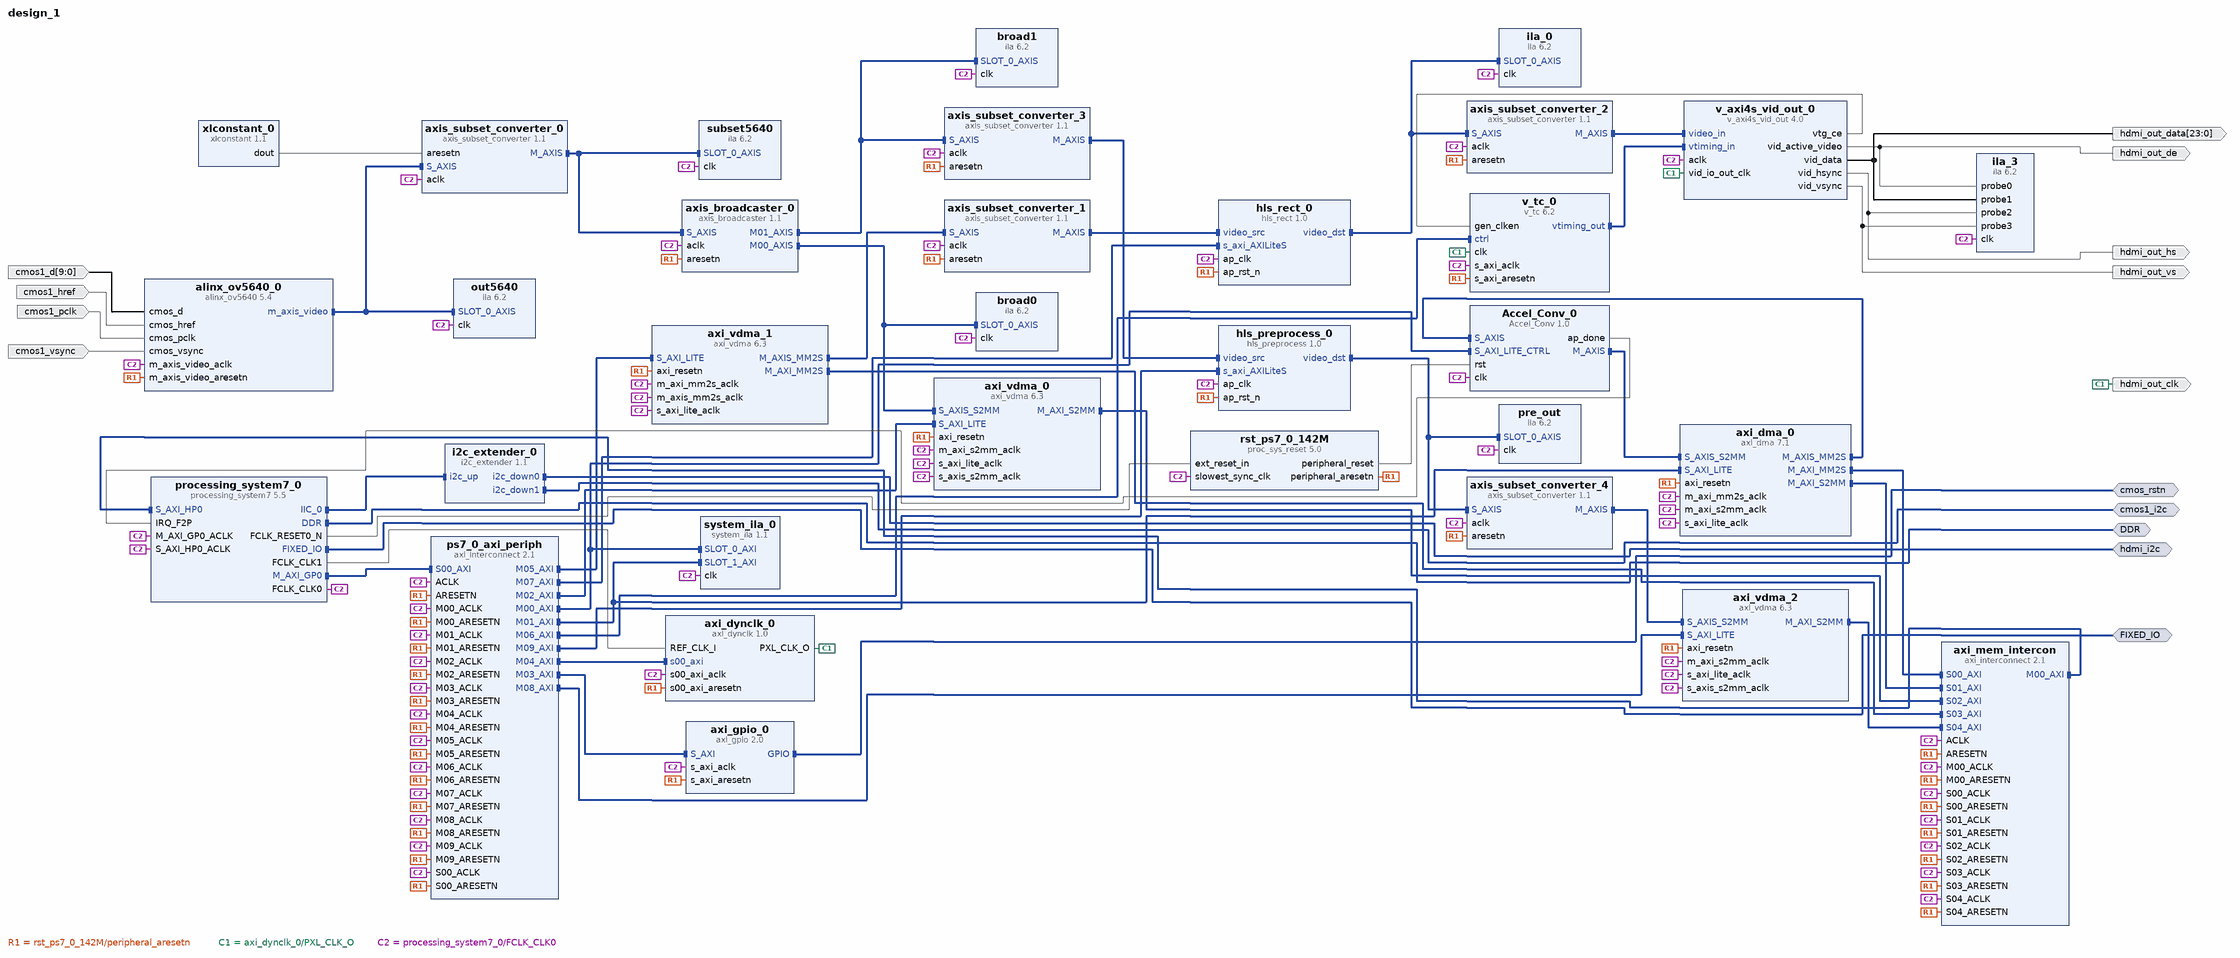
[diagram p0: block diagram of the top level]
# Vivado block design design_1, xc7z035ffg676-2, Vivado 2021.1
create_bd_design design_1

create_bd_intf_port -mode Master -vlnv xilinx.com:interface:ddrx_rtl:1.0 DDR
create_bd_intf_port -mode Master -vlnv xilinx.com:display_processing_system7:fixedio_rtl:1.0 FIXED_IO
create_bd_intf_port -mode Master -vlnv xilinx.com:interface:gpio_rtl:1.0 cmos_rstn
create_bd_intf_port -mode Master -vlnv xilinx.com:interface:iic_rtl:1.0 hdmi_i2c
create_bd_intf_port -mode Master -vlnv xilinx.com:interface:iic_rtl:1.0 cmos1_i2c
create_bd_port -dir O -type clk hdmi_out_clk
create_bd_port -dir O hdmi_out_de
create_bd_port -dir O -from 23 -to 0 hdmi_out_data
create_bd_port -dir O hdmi_out_hs
create_bd_port -dir O hdmi_out_vs
create_bd_port -dir I cmos1_vsync
create_bd_port -dir I cmos1_href
create_bd_port -dir I cmos1_pclk
create_bd_port -dir I -from 9 -to 0 cmos1_d

create_bd_cell -type ip -vlnv xilinx.com:ip:processing_system7:5.5 processing_system7_0
set_property -dict [list \
  CONFIG.PCW_APU_PERIPHERAL_FREQMHZ 666.666666 \
  CONFIG.PCW_CPU_CPU_6X4X_MAX_RANGE 800 \
  CONFIG.PCW_DUAL_PARALLEL_QSPI_DATA_MODE x8 \
  CONFIG.PCW_ENET0_ENET0_IO {MIO 16 .. 27} \
  CONFIG.PCW_ENET0_GRP_MDIO_ENABLE 1 \
  CONFIG.PCW_ENET0_GRP_MDIO_IO {MIO 52 .. 53} \
  CONFIG.PCW_ENET0_PERIPHERAL_ENABLE 1 \
  CONFIG.PCW_ENET_RESET_ENABLE 0 \
  CONFIG.PCW_EN_CLK1_PORT 1 \
  CONFIG.PCW_FCLK_CLK1_BUF TRUE \
  CONFIG.PCW_FPGA0_PERIPHERAL_FREQMHZ 200 \
  CONFIG.PCW_FPGA1_PERIPHERAL_FREQMHZ 100 \
  CONFIG.PCW_FPGA_FCLK1_ENABLE 1 \
  CONFIG.PCW_GPIO_MIO_GPIO_ENABLE 1 \
  CONFIG.PCW_GPIO_MIO_GPIO_IO MIO \
  CONFIG.PCW_I2C0_I2C0_IO EMIO \
  CONFIG.PCW_I2C0_PERIPHERAL_ENABLE 1 \
  CONFIG.PCW_I2C_PERIPHERAL_FREQMHZ 111.111115 \
  CONFIG.PCW_I2C_RESET_ENABLE 0 \
  CONFIG.PCW_IRQ_F2P_INTR 1 \
  CONFIG.PCW_PERIPHERAL_BOARD_PRESET None \
  CONFIG.PCW_PRESET_BANK1_VOLTAGE {LVCMOS 1.8V} \
  CONFIG.PCW_QSPI_GRP_FBCLK_ENABLE 1 \
  CONFIG.PCW_QSPI_GRP_IO1_ENABLE 1 \
  CONFIG.PCW_QSPI_GRP_IO1_IO {MIO 0 9 .. 13} \
  CONFIG.PCW_QSPI_GRP_SINGLE_SS_ENABLE 0 \
  CONFIG.PCW_QSPI_INTERNAL_HIGHADDRESS 0xFDFFFFFF \
  CONFIG.PCW_QSPI_PERIPHERAL_ENABLE 1 \
  CONFIG.PCW_QSPI_QSPI_IO {MIO 1 .. 6} \
  CONFIG.PCW_SD0_GRP_CD_ENABLE 0 \
  CONFIG.PCW_SD0_GRP_WP_ENABLE 0 \
  CONFIG.PCW_SD0_PERIPHERAL_ENABLE 1 \
  CONFIG.PCW_SD0_SD0_IO {MIO 40 .. 45} \
  CONFIG.PCW_SD1_PERIPHERAL_ENABLE 1 \
  CONFIG.PCW_SD1_SD1_IO {MIO 46 .. 51} \
  CONFIG.PCW_SDIO_PERIPHERAL_FREQMHZ 100 \
  CONFIG.PCW_UART0_PERIPHERAL_ENABLE 1 \
  CONFIG.PCW_UART0_UART0_IO {MIO 14 .. 15} \
  CONFIG.PCW_UART1_PERIPHERAL_ENABLE 0 \
  CONFIG.PCW_UART_PERIPHERAL_FREQMHZ 100 \
  CONFIG.PCW_UIPARAM_DDR_FREQ_MHZ 533.333333 \
  CONFIG.PCW_UIPARAM_DDR_PARTNO {MT41J256M16 RE-125} \
  CONFIG.PCW_USB0_PERIPHERAL_ENABLE 1 \
  CONFIG.PCW_USB0_USB0_IO {MIO 28 .. 39} \
  CONFIG.PCW_USB_RESET_ENABLE 0 \
  CONFIG.PCW_USE_FABRIC_INTERRUPT 1 \
  CONFIG.PCW_USE_S_AXI_HP0 1 \
] [get_bd_cells processing_system7_0]
# 516 more settings of processing_system7_0 are not shown: defaults, MIO pin electricals, DDR timing, and values the tool derives
create_bd_cell -type ip -vlnv xilinx.com:ip:axi_dma:7.1 axi_dma_0
set_property -dict [list \
  CONFIG.c_include_sg 0 \
  CONFIG.c_m_axi_mm2s_data_width 64 \
  CONFIG.c_m_axi_s2mm_data_width 64 \
  CONFIG.c_m_axis_mm2s_tdata_width 64 \
  CONFIG.c_mm2s_burst_size 256 \
  CONFIG.c_s2mm_burst_size 256 \
  CONFIG.c_s_axis_s2mm_tdata_width 64 \
  CONFIG.c_sg_length_width 19 \
] [get_bd_cells axi_dma_0]
create_bd_cell -type ip -vlnv xilinx.com:ip:axi_interconnect:2.1 ps7_0_axi_periph
set_property -dict {CONFIG.NUM_MI 10} [get_bd_cells ps7_0_axi_periph]
create_bd_cell -type ip -vlnv xilinx.com:ip:proc_sys_reset:5.0 rst_ps7_0_142M
create_bd_cell -type ip -vlnv xilinx.com:ip:axi_interconnect:2.1 axi_mem_intercon
set_property -dict {CONFIG.NUM_MI 1 CONFIG.NUM_SI 5} [get_bd_cells axi_mem_intercon]
create_bd_cell -type ip -vlnv xilinx.com:ip:system_ila:1.1 system_ila_0
set_property -dict [list \
  CONFIG.C_MON_TYPE INTERFACE \
  CONFIG.C_NUM_MONITOR_SLOTS 2 \
  CONFIG.C_SLOT_0_APC_EN 0 \
  CONFIG.C_SLOT_0_AXI_AR_SEL_DATA 1 \
  CONFIG.C_SLOT_0_AXI_AR_SEL_TRIG 1 \
  CONFIG.C_SLOT_0_AXI_AW_SEL_DATA 1 \
  CONFIG.C_SLOT_0_AXI_AW_SEL_TRIG 1 \
  CONFIG.C_SLOT_0_AXI_B_SEL_DATA 1 \
  CONFIG.C_SLOT_0_AXI_B_SEL_TRIG 1 \
  CONFIG.C_SLOT_0_AXI_R_SEL_DATA 1 \
  CONFIG.C_SLOT_0_AXI_R_SEL_TRIG 1 \
  CONFIG.C_SLOT_0_AXI_W_SEL_DATA 1 \
  CONFIG.C_SLOT_0_AXI_W_SEL_TRIG 1 \
  CONFIG.C_SLOT_0_INTF_TYPE xilinx.com:interface:aximm_rtl:1.0 \
  CONFIG.C_SLOT_1_APC_EN 0 \
  CONFIG.C_SLOT_1_AXI_AR_SEL_DATA 1 \
  CONFIG.C_SLOT_1_AXI_AR_SEL_TRIG 1 \
  CONFIG.C_SLOT_1_AXI_AW_SEL_DATA 1 \
  CONFIG.C_SLOT_1_AXI_AW_SEL_TRIG 1 \
  CONFIG.C_SLOT_1_AXI_B_SEL_DATA 1 \
  CONFIG.C_SLOT_1_AXI_B_SEL_TRIG 1 \
  CONFIG.C_SLOT_1_AXI_R_SEL_DATA 1 \
  CONFIG.C_SLOT_1_AXI_R_SEL_TRIG 1 \
  CONFIG.C_SLOT_1_AXI_W_SEL_DATA 1 \
  CONFIG.C_SLOT_1_AXI_W_SEL_TRIG 1 \
  CONFIG.C_SLOT_1_INTF_TYPE xilinx.com:interface:aximm_rtl:1.0 \
] [get_bd_cells system_ila_0]
create_bd_cell -type ip -vlnv www.alinx.com.cn:user:alinx_ov5640:5.4 alinx_ov5640_0
create_bd_cell -type ip -vlnv xilinx.com:ip:axis_subset_converter:1.1 axis_subset_converter_0
set_property -dict [list \
  CONFIG.M_HAS_TKEEP 1 \
  CONFIG.M_HAS_TLAST 1 \
  CONFIG.M_TDATA_NUM_BYTES 3 \
  CONFIG.M_TUSER_WIDTH 1 \
  CONFIG.S_HAS_TKEEP 1 \
  CONFIG.S_HAS_TLAST 1 \
  CONFIG.S_TDATA_NUM_BYTES 2 \
  CONFIG.S_TUSER_WIDTH 1 \
  CONFIG.TDATA_REMAP {tdata[4:0],3'b000,tdata[10:5],2'b00,tdata[15:11],3'b000} \
  CONFIG.TKEEP_REMAP {1'b1,tkeep[1:0]} \
  CONFIG.TLAST_REMAP {tlast[0]} \
  CONFIG.TUSER_REMAP {tuser[0:0]} \
] [get_bd_cells axis_subset_converter_0]
create_bd_cell -type ip -vlnv xilinx.com:ip:axi_vdma:6.3 axi_vdma_0
set_property -dict [list \
  CONFIG.c_include_mm2s 0 \
  CONFIG.c_include_s2mm_dre 1 \
  CONFIG.c_m_axi_s2mm_data_width 64 \
  CONFIG.c_num_fstores 1 \
  CONFIG.c_s2mm_genlock_mode 0 \
  CONFIG.c_s2mm_linebuffer_depth 4096 \
  CONFIG.c_s2mm_max_burst_length 128 \
] [get_bd_cells axi_vdma_0]
create_bd_cell -type ip -vlnv xilinx.com:ip:xlconstant:1.1 xlconstant_0
create_bd_cell -type ip -vlnv xilinx.com:ip:axi_gpio:2.0 axi_gpio_0
set_property -dict {CONFIG.C_ALL_OUTPUTS 1 CONFIG.C_GPIO_WIDTH 1} [get_bd_cells axi_gpio_0]
create_bd_cell -type ip -vlnv digilentinc.com:ip:axi_dynclk:1.0 axi_dynclk_0
create_bd_cell -type ip -vlnv xilinx.com:ip:v_tc:6.2 v_tc_0
set_property -dict {CONFIG.enable_detection false} [get_bd_cells v_tc_0]
create_bd_cell -type ip -vlnv xilinx.com:ip:v_axi4s_vid_out:4.0 v_axi4s_vid_out_0
set_property -dict {CONFIG.C_HAS_ASYNC_CLK 1 CONFIG.C_VTG_MASTER_SLAVE 1} [get_bd_cells v_axi4s_vid_out_0]
create_bd_cell -type ip -vlnv xilinx.com:ip:axi_vdma:6.3 axi_vdma_1
set_property -dict [list \
  CONFIG.c_include_mm2s 1 \
  CONFIG.c_include_s2mm 0 \
  CONFIG.c_m_axis_mm2s_tdata_width 24 \
  CONFIG.c_mm2s_genlock_mode 3 \
  CONFIG.c_mm2s_max_burst_length 128 \
  CONFIG.c_num_fstores 1 \
] [get_bd_cells axi_vdma_1]
create_bd_cell -type ip -vlnv alinx.com.cn:user:i2c_extender:1.1 i2c_extender_0
create_bd_cell -type ip -vlnv xilinx.com:ip:ila:6.2 ila_3
set_property -dict [list \
  CONFIG.C_ENABLE_ILA_AXI_MON false \
  CONFIG.C_MONITOR_TYPE Native \
  CONFIG.C_NUM_OF_PROBES 4 \
  CONFIG.C_PROBE1_WIDTH 24 \
] [get_bd_cells ila_3]
create_bd_cell -type ip -vlnv xilinx.com:ip:axis_subset_converter:1.1 axis_subset_converter_1
set_property -dict [list \
  CONFIG.M_TDATA_NUM_BYTES 4 \
  CONFIG.S_TDATA_NUM_BYTES 3 \
  CONFIG.TDATA_REMAP {8'b00000000,tdata[23:0]} \
] [get_bd_cells axis_subset_converter_1]
create_bd_cell -type ip -vlnv xilinx.com:hls:hls_rect:1.0 hls_rect_0
create_bd_cell -type ip -vlnv xilinx.com:ip:axis_subset_converter:1.1 axis_subset_converter_2
set_property -dict [list \
  CONFIG.M_TDATA_NUM_BYTES 3 \
  CONFIG.S_TDATA_NUM_BYTES 4 \
  CONFIG.TDATA_REMAP {tdata[23:0]} \
] [get_bd_cells axis_subset_converter_2]
create_bd_cell -type ip -vlnv xilinx.com:ip:ila:6.2 ila_0
set_property -dict {CONFIG.C_NUM_OF_PROBES 9 CONFIG.C_SLOT_0_AXI_PROTOCOL AXI4S} [get_bd_cells ila_0]
create_bd_cell -type ip -vlnv xilinx.com:ip:ila:6.2 out5640
set_property -dict {CONFIG.C_NUM_OF_PROBES 9 CONFIG.C_SLOT_0_AXI_PROTOCOL AXI4S} [get_bd_cells out5640]
create_bd_cell -type ip -vlnv xilinx.com:ip:ila:6.2 subset5640
set_property -dict {CONFIG.C_NUM_OF_PROBES 9 CONFIG.C_SLOT_0_AXI_PROTOCOL AXI4S} [get_bd_cells subset5640]
create_bd_cell -type ip -vlnv xilinx.com:ip:axis_subset_converter:1.1 axis_subset_converter_3
set_property -dict [list \
  CONFIG.M_TDATA_NUM_BYTES 4 \
  CONFIG.S_TDATA_NUM_BYTES 3 \
  CONFIG.TDATA_REMAP {8'b00000000,tdata[23:0]} \
] [get_bd_cells axis_subset_converter_3]
create_bd_cell -type ip -vlnv xilinx.com:ip:axis_broadcaster:1.1 axis_broadcaster_0
set_property -dict [list \
  CONFIG.M00_TDATA_REMAP {tdata[23:0]} \
  CONFIG.M01_TDATA_REMAP {tdata[23:0]} \
  CONFIG.M_TDATA_NUM_BYTES 3 \
  CONFIG.S_TDATA_NUM_BYTES 3 \
] [get_bd_cells axis_broadcaster_0]
create_bd_cell -type ip -vlnv xilinx.com:ip:ila:6.2 broad0
set_property -dict {CONFIG.C_NUM_OF_PROBES 9 CONFIG.C_SLOT_0_AXI_PROTOCOL AXI4S} [get_bd_cells broad0]
create_bd_cell -type ip -vlnv xilinx.com:ip:ila:6.2 broad1
set_property -dict {CONFIG.C_NUM_OF_PROBES 9 CONFIG.C_SLOT_0_AXI_PROTOCOL AXI4S} [get_bd_cells broad1]
create_bd_cell -type ip -vlnv xilinx.com:ip:axi_vdma:6.3 axi_vdma_2
set_property -dict {CONFIG.c_include_mm2s 0} [get_bd_cells axi_vdma_2]
create_bd_cell -type ip -vlnv xilinx.com:ip:ila:6.2 pre_out
set_property -dict {CONFIG.C_NUM_OF_PROBES 9 CONFIG.C_SLOT_0_AXI_PROTOCOL AXI4S} [get_bd_cells pre_out]
create_bd_cell -type ip -vlnv xilinx.com:ip:axis_subset_converter:1.1 axis_subset_converter_4
set_property -dict [list \
  CONFIG.M_TDATA_NUM_BYTES 8 \
  CONFIG.S_TDATA_NUM_BYTES 4 \
  CONFIG.TDATA_REMAP {32'b00000000000000000000000000000000,tdata[31:0]} \
] [get_bd_cells axis_subset_converter_4]
create_bd_cell -type ip -vlnv xilinx.com:hls:hls_preprocess:1.0 hls_preprocess_0
create_bd_cell -type ip -vlnv xilinx.com:user:Accel_Conv:1.0 Accel_Conv_0

# ---- connections ----

connect_bd_intf_net [get_bd_intf_pins Accel_Conv_0/M_AXIS] [get_bd_intf_pins axi_dma_0/S_AXIS_S2MM]
connect_bd_intf_net [get_bd_intf_pins alinx_ov5640_0/m_axis_video] [get_bd_intf_pins axis_subset_converter_0/S_AXIS]
connect_bd_intf_net [get_bd_intf_pins alinx_ov5640_0/m_axis_video] [get_bd_intf_pins out5640/SLOT_0_AXIS]
connect_bd_intf_net [get_bd_intf_pins Accel_Conv_0/S_AXIS] [get_bd_intf_pins axi_dma_0/M_AXIS_MM2S]
connect_bd_intf_net [get_bd_intf_pins axi_dma_0/M_AXI_MM2S] [get_bd_intf_pins axi_mem_intercon/S00_AXI]
connect_bd_intf_net [get_bd_intf_pins axi_dma_0/M_AXI_S2MM] [get_bd_intf_pins axi_mem_intercon/S01_AXI]
connect_bd_intf_net [get_bd_intf_ports cmos_rstn] [get_bd_intf_pins axi_gpio_0/GPIO]
connect_bd_intf_net [get_bd_intf_pins axi_mem_intercon/M00_AXI] [get_bd_intf_pins processing_system7_0/S_AXI_HP0]
connect_bd_intf_net [get_bd_intf_pins axi_vdma_0/M_AXI_S2MM] [get_bd_intf_pins axi_mem_intercon/S02_AXI]
connect_bd_intf_net [get_bd_intf_pins axi_vdma_1/M_AXIS_MM2S] [get_bd_intf_pins axis_subset_converter_1/S_AXIS]
connect_bd_intf_net [get_bd_intf_pins axi_vdma_1/M_AXI_MM2S] [get_bd_intf_pins axi_mem_intercon/S03_AXI]
connect_bd_intf_net [get_bd_intf_pins axi_vdma_2/M_AXI_S2MM] [get_bd_intf_pins axi_mem_intercon/S04_AXI]
connect_bd_intf_net [get_bd_intf_pins axis_broadcaster_0/M00_AXIS] [get_bd_intf_pins axi_vdma_0/S_AXIS_S2MM]
connect_bd_intf_net [get_bd_intf_pins axis_broadcaster_0/M00_AXIS] [get_bd_intf_pins broad0/SLOT_0_AXIS]
connect_bd_intf_net [get_bd_intf_pins axis_broadcaster_0/M01_AXIS] [get_bd_intf_pins axis_subset_converter_3/S_AXIS]
connect_bd_intf_net [get_bd_intf_pins axis_broadcaster_0/M01_AXIS] [get_bd_intf_pins broad1/SLOT_0_AXIS]
connect_bd_intf_net [get_bd_intf_pins axis_subset_converter_0/M_AXIS] [get_bd_intf_pins axis_broadcaster_0/S_AXIS]
connect_bd_intf_net [get_bd_intf_pins axis_subset_converter_0/M_AXIS] [get_bd_intf_pins subset5640/SLOT_0_AXIS]
connect_bd_intf_net [get_bd_intf_pins axis_subset_converter_1/M_AXIS] [get_bd_intf_pins hls_rect_0/video_src]
connect_bd_intf_net [get_bd_intf_pins axis_subset_converter_2/M_AXIS] [get_bd_intf_pins v_axi4s_vid_out_0/video_in]
connect_bd_intf_net [get_bd_intf_pins axis_subset_converter_3/M_AXIS] [get_bd_intf_pins hls_preprocess_0/video_src]
connect_bd_intf_net [get_bd_intf_pins axis_subset_converter_4/M_AXIS] [get_bd_intf_pins axi_vdma_2/S_AXIS_S2MM]
connect_bd_intf_net [get_bd_intf_pins axis_subset_converter_4/S_AXIS] [get_bd_intf_pins hls_preprocess_0/video_dst]
connect_bd_intf_net [get_bd_intf_pins axis_subset_converter_4/S_AXIS] [get_bd_intf_pins pre_out/SLOT_0_AXIS]
connect_bd_intf_net [get_bd_intf_pins hls_rect_0/video_dst] [get_bd_intf_pins axis_subset_converter_2/S_AXIS]
connect_bd_intf_net [get_bd_intf_pins hls_rect_0/video_dst] [get_bd_intf_pins ila_0/SLOT_0_AXIS]
connect_bd_intf_net [get_bd_intf_ports hdmi_i2c] [get_bd_intf_pins i2c_extender_0/i2c_down0]
connect_bd_intf_net [get_bd_intf_ports cmos1_i2c] [get_bd_intf_pins i2c_extender_0/i2c_down1]
connect_bd_intf_net [get_bd_intf_ports DDR] [get_bd_intf_pins processing_system7_0/DDR]
connect_bd_intf_net [get_bd_intf_ports FIXED_IO] [get_bd_intf_pins processing_system7_0/FIXED_IO]
connect_bd_intf_net [get_bd_intf_pins processing_system7_0/IIC_0] [get_bd_intf_pins i2c_extender_0/i2c_up]
connect_bd_intf_net [get_bd_intf_pins processing_system7_0/M_AXI_GP0] [get_bd_intf_pins ps7_0_axi_periph/S00_AXI]
connect_bd_intf_net -intf_net ps7_0_axi_periph_M00_AXI [get_bd_intf_pins ps7_0_axi_periph/M00_AXI] [get_bd_intf_pins Accel_Conv_0/S_AXI_LITE_CTRL]
connect_bd_intf_net [get_bd_intf_pins ps7_0_axi_periph/M00_AXI] [get_bd_intf_pins system_ila_0/SLOT_0_AXI]
connect_bd_intf_net -intf_net ps7_0_axi_periph_M01_AXI [get_bd_intf_pins ps7_0_axi_periph/M01_AXI] [get_bd_intf_pins axi_dma_0/S_AXI_LITE]
connect_bd_intf_net [get_bd_intf_pins ps7_0_axi_periph/M01_AXI] [get_bd_intf_pins system_ila_0/SLOT_1_AXI]
connect_bd_intf_net [get_bd_intf_pins ps7_0_axi_periph/M02_AXI] [get_bd_intf_pins axi_vdma_0/S_AXI_LITE]
connect_bd_intf_net [get_bd_intf_pins ps7_0_axi_periph/M03_AXI] [get_bd_intf_pins axi_gpio_0/S_AXI]
connect_bd_intf_net [get_bd_intf_pins ps7_0_axi_periph/M04_AXI] [get_bd_intf_pins axi_dynclk_0/s00_axi]
connect_bd_intf_net [get_bd_intf_pins ps7_0_axi_periph/M05_AXI] [get_bd_intf_pins axi_vdma_1/S_AXI_LITE]
connect_bd_intf_net [get_bd_intf_pins ps7_0_axi_periph/M06_AXI] [get_bd_intf_pins v_tc_0/ctrl]
connect_bd_intf_net [get_bd_intf_pins ps7_0_axi_periph/M07_AXI] [get_bd_intf_pins hls_rect_0/s_axi_AXILiteS]
connect_bd_intf_net [get_bd_intf_pins ps7_0_axi_periph/M08_AXI] [get_bd_intf_pins axi_vdma_2/S_AXI_LITE]
connect_bd_intf_net [get_bd_intf_pins ps7_0_axi_periph/M09_AXI] [get_bd_intf_pins hls_preprocess_0/s_axi_AXILiteS]
connect_bd_intf_net [get_bd_intf_pins v_tc_0/vtiming_out] [get_bd_intf_pins v_axi4s_vid_out_0/vtiming_in]
connect_bd_net -net ARESETN_1 [get_bd_pins rst_ps7_0_142M/peripheral_aresetn] \
  [get_bd_pins ps7_0_axi_periph/ARESETN] [get_bd_pins ps7_0_axi_periph/S00_ARESETN] \
  [get_bd_pins ps7_0_axi_periph/M00_ARESETN] [get_bd_pins ps7_0_axi_periph/M01_ARESETN] \
  [get_bd_pins alinx_ov5640_0/m_axis_video_aresetn] [get_bd_pins axi_mem_intercon/S02_ARESETN] \
  [get_bd_pins axi_vdma_0/axi_resetn] [get_bd_pins ps7_0_axi_periph/M02_ARESETN] [get_bd_pins axi_dma_0/axi_resetn] \
  [get_bd_pins axi_gpio_0/s_axi_aresetn] [get_bd_pins ps7_0_axi_periph/M03_ARESETN] [get_bd_pins axi_mem_intercon/ARESETN] \
  [get_bd_pins axi_mem_intercon/S00_ARESETN] [get_bd_pins axi_mem_intercon/M00_ARESETN] \
  [get_bd_pins axi_mem_intercon/S01_ARESETN] [get_bd_pins axi_dynclk_0/s00_axi_aresetn] \
  [get_bd_pins ps7_0_axi_periph/M04_ARESETN] [get_bd_pins axi_mem_intercon/S03_ARESETN] [get_bd_pins axi_vdma_1/axi_resetn] \
  [get_bd_pins ps7_0_axi_periph/M05_ARESETN] [get_bd_pins v_tc_0/s_axi_aresetn] [get_bd_pins ps7_0_axi_periph/M06_ARESETN] \
  [get_bd_pins ps7_0_axi_periph/M07_ARESETN] [get_bd_pins axis_subset_converter_1/aresetn] [get_bd_pins hls_rect_0/ap_rst_n] \
  [get_bd_pins axis_subset_converter_2/aresetn] [get_bd_pins axi_mem_intercon/S04_ARESETN] \
  [get_bd_pins axi_vdma_2/axi_resetn] [get_bd_pins ps7_0_axi_periph/M08_ARESETN] [get_bd_pins axis_broadcaster_0/aresetn] \
  [get_bd_pins axis_subset_converter_3/aresetn] [get_bd_pins ps7_0_axi_periph/M09_ARESETN] \
  [get_bd_pins axis_subset_converter_4/aresetn] [get_bd_pins hls_preprocess_0/ap_rst_n]
connect_bd_net [get_bd_pins Accel_Conv_0/ap_done] [get_bd_pins processing_system7_0/IRQ_F2P]
connect_bd_net [get_bd_pins axi_dynclk_0/PXL_CLK_O] \
  [get_bd_ports hdmi_out_clk] [get_bd_pins v_tc_0/clk] [get_bd_pins v_axi4s_vid_out_0/vid_io_out_clk]
connect_bd_net -net cmos_d_0_1 [get_bd_ports cmos1_d] [get_bd_pins alinx_ov5640_0/cmos_d]
connect_bd_net -net cmos_href_0_1 [get_bd_ports cmos1_href] [get_bd_pins alinx_ov5640_0/cmos_href]
connect_bd_net -net cmos_pclk_0_1 [get_bd_ports cmos1_pclk] [get_bd_pins alinx_ov5640_0/cmos_pclk]
connect_bd_net -net cmos_vsync_0_1 [get_bd_ports cmos1_vsync] [get_bd_pins alinx_ov5640_0/cmos_vsync]
connect_bd_net [get_bd_pins processing_system7_0/FCLK_CLK0] \
  [get_bd_pins processing_system7_0/M_AXI_GP0_ACLK] [get_bd_pins processing_system7_0/S_AXI_HP0_ACLK] \
  [get_bd_pins axi_dma_0/s_axi_lite_aclk] [get_bd_pins axi_dma_0/m_axi_mm2s_aclk] [get_bd_pins axi_dma_0/m_axi_s2mm_aclk] \
  [get_bd_pins ps7_0_axi_periph/ACLK] [get_bd_pins ps7_0_axi_periph/S00_ACLK] [get_bd_pins rst_ps7_0_142M/slowest_sync_clk] \
  [get_bd_pins ps7_0_axi_periph/M00_ACLK] [get_bd_pins ps7_0_axi_periph/M01_ACLK] [get_bd_pins axi_mem_intercon/ACLK] \
  [get_bd_pins axi_mem_intercon/S00_ACLK] [get_bd_pins axi_mem_intercon/M00_ACLK] [get_bd_pins axi_mem_intercon/S01_ACLK] \
  [get_bd_pins system_ila_0/clk] [get_bd_pins axi_vdma_0/s_axi_lite_aclk] [get_bd_pins axi_vdma_0/m_axi_s2mm_aclk] \
  [get_bd_pins axi_vdma_0/s_axis_s2mm_aclk] [get_bd_pins alinx_ov5640_0/m_axis_video_aclk] \
  [get_bd_pins axis_subset_converter_0/aclk] [get_bd_pins axi_mem_intercon/S02_ACLK] [get_bd_pins ps7_0_axi_periph/M02_ACLK] \
  [get_bd_pins axi_gpio_0/s_axi_aclk] [get_bd_pins ps7_0_axi_periph/M03_ACLK] [get_bd_pins axi_dynclk_0/s00_axi_aclk] \
  [get_bd_pins ps7_0_axi_periph/M04_ACLK] [get_bd_pins axi_vdma_1/s_axi_lite_aclk] [get_bd_pins axi_vdma_1/m_axis_mm2s_aclk] \
  [get_bd_pins axi_vdma_1/m_axi_mm2s_aclk] [get_bd_pins v_tc_0/s_axi_aclk] [get_bd_pins axi_mem_intercon/S03_ACLK] \
  [get_bd_pins ps7_0_axi_periph/M05_ACLK] [get_bd_pins v_axi4s_vid_out_0/aclk] [get_bd_pins ps7_0_axi_periph/M06_ACLK] \
  [get_bd_pins ps7_0_axi_periph/M07_ACLK] [get_bd_pins ila_3/clk] [get_bd_pins axis_subset_converter_1/aclk] \
  [get_bd_pins hls_rect_0/ap_clk] [get_bd_pins axis_subset_converter_2/aclk] [get_bd_pins ila_0/clk] \
  [get_bd_pins out5640/clk] [get_bd_pins subset5640/clk] [get_bd_pins axi_vdma_2/m_axi_s2mm_aclk] \
  [get_bd_pins axi_mem_intercon/S04_ACLK] [get_bd_pins axi_vdma_2/s_axi_lite_aclk] [get_bd_pins ps7_0_axi_periph/M08_ACLK] \
  [get_bd_pins axi_vdma_2/s_axis_s2mm_aclk] [get_bd_pins axis_broadcaster_0/aclk] [get_bd_pins axis_subset_converter_3/aclk] \
  [get_bd_pins broad0/clk] [get_bd_pins broad1/clk] [get_bd_pins ps7_0_axi_periph/M09_ACLK] [get_bd_pins pre_out/clk] \
  [get_bd_pins axis_subset_converter_4/aclk] [get_bd_pins hls_preprocess_0/ap_clk] [get_bd_pins Accel_Conv_0/clk]
connect_bd_net [get_bd_pins processing_system7_0/FCLK_CLK1] [get_bd_pins axi_dynclk_0/REF_CLK_I]
connect_bd_net [get_bd_pins processing_system7_0/FCLK_RESET0_N] [get_bd_pins rst_ps7_0_142M/ext_reset_in]
connect_bd_net [get_bd_pins rst_ps7_0_142M/peripheral_reset] [get_bd_pins Accel_Conv_0/rst]
connect_bd_net -net v_axi4s_vid_out_0_vid_active_video [get_bd_pins v_axi4s_vid_out_0/vid_active_video] \
  [get_bd_ports hdmi_out_de] [get_bd_pins ila_3/probe0]
connect_bd_net -net v_axi4s_vid_out_0_vid_data [get_bd_pins v_axi4s_vid_out_0/vid_data] [get_bd_ports hdmi_out_data] [get_bd_pins ila_3/probe1]
connect_bd_net -net v_axi4s_vid_out_0_vid_hsync [get_bd_pins v_axi4s_vid_out_0/vid_hsync] [get_bd_ports hdmi_out_hs] [get_bd_pins ila_3/probe2]
connect_bd_net -net v_axi4s_vid_out_0_vid_vsync [get_bd_pins v_axi4s_vid_out_0/vid_vsync] [get_bd_ports hdmi_out_vs] [get_bd_pins ila_3/probe3]
connect_bd_net [get_bd_pins v_axi4s_vid_out_0/vtg_ce] [get_bd_pins v_tc_0/gen_clken]
connect_bd_net [get_bd_pins xlconstant_0/dout] [get_bd_pins axis_subset_converter_0/aresetn]
set_property HDL_ATTRIBUTE.DEBUG true [get_bd_intf_nets ps7_0_axi_periph_M00_AXI]
set_property HDL_ATTRIBUTE.MARK_DEBUG true [get_bd_intf_nets ps7_0_axi_periph_M00_AXI]
set_property HDL_ATTRIBUTE.DEBUG true [get_bd_intf_nets ps7_0_axi_periph_M01_AXI]
set_property HDL_ATTRIBUTE.MARK_DEBUG true [get_bd_intf_nets ps7_0_axi_periph_M01_AXI]
set_property HDL_ATTRIBUTE.DEBUG true [get_bd_nets v_axi4s_vid_out_0_vid_active_video]
set_property HDL_ATTRIBUTE.MARK_DEBUG true [get_bd_nets v_axi4s_vid_out_0_vid_active_video]
set_property HDL_ATTRIBUTE.DEBUG true [get_bd_nets v_axi4s_vid_out_0_vid_data]
set_property HDL_ATTRIBUTE.MARK_DEBUG true [get_bd_nets v_axi4s_vid_out_0_vid_data]
set_property HDL_ATTRIBUTE.DEBUG true [get_bd_nets v_axi4s_vid_out_0_vid_hsync]
set_property HDL_ATTRIBUTE.MARK_DEBUG true [get_bd_nets v_axi4s_vid_out_0_vid_hsync]
set_property HDL_ATTRIBUTE.DEBUG true [get_bd_nets v_axi4s_vid_out_0_vid_vsync]
set_property HDL_ATTRIBUTE.MARK_DEBUG true [get_bd_nets v_axi4s_vid_out_0_vid_vsync]

# ---- address map ----
assign_bd_address -offset 0x00000000 -range 1G -target_address_space [get_bd_addr_spaces axi_dma_0/Data_MM2S] [get_bd_addr_segs processing_system7_0/S_AXI_HP0/HP0_DDR_LOWOCM]
assign_bd_address -offset 0x00000000 -range 1G -target_address_space [get_bd_addr_spaces axi_dma_0/Data_S2MM] [get_bd_addr_segs processing_system7_0/S_AXI_HP0/HP0_DDR_LOWOCM]
assign_bd_address -offset 0x00000000 -range 1G -target_address_space [get_bd_addr_spaces axi_vdma_0/Data_S2MM] [get_bd_addr_segs processing_system7_0/S_AXI_HP0/HP0_DDR_LOWOCM]
assign_bd_address -offset 0x00000000 -range 1G -target_address_space [get_bd_addr_spaces axi_vdma_1/Data_MM2S] [get_bd_addr_segs processing_system7_0/S_AXI_HP0/HP0_DDR_LOWOCM]
assign_bd_address -offset 0x00000000 -range 1G -target_address_space [get_bd_addr_spaces axi_vdma_2/Data_S2MM] [get_bd_addr_segs processing_system7_0/S_AXI_HP0/HP0_DDR_LOWOCM]
assign_bd_address -offset 0x40400000 -range 64K -target_address_space [get_bd_addr_spaces processing_system7_0/Data] [get_bd_addr_segs axi_dma_0/S_AXI_LITE/Reg]
assign_bd_address -offset 0x41200000 -range 64K -target_address_space [get_bd_addr_spaces processing_system7_0/Data] [get_bd_addr_segs axi_gpio_0/S_AXI/Reg]
assign_bd_address -offset 0x43000000 -range 64K -target_address_space [get_bd_addr_spaces processing_system7_0/Data] [get_bd_addr_segs axi_vdma_0/S_AXI_LITE/Reg]
assign_bd_address -offset 0x43010000 -range 64K -target_address_space [get_bd_addr_spaces processing_system7_0/Data] [get_bd_addr_segs axi_vdma_1/S_AXI_LITE/Reg]
assign_bd_address -offset 0x43020000 -range 64K -target_address_space [get_bd_addr_spaces processing_system7_0/Data] [get_bd_addr_segs axi_vdma_2/S_AXI_LITE/Reg]
assign_bd_address -offset 0x43C00000 -range 64K -target_address_space [get_bd_addr_spaces processing_system7_0/Data] [get_bd_addr_segs Accel_Conv_0/S_AXI_LITE_CTRL/reg0]
assign_bd_address -offset 0x43C10000 -range 64K -target_address_space [get_bd_addr_spaces processing_system7_0/Data] [get_bd_addr_segs axi_dynclk_0/s00_axi/reg0]
assign_bd_address -offset 0x43C20000 -range 64K -target_address_space [get_bd_addr_spaces processing_system7_0/Data] [get_bd_addr_segs v_tc_0/ctrl/Reg]
assign_bd_address -offset 0x43C30000 -range 64K -target_address_space [get_bd_addr_spaces processing_system7_0/Data] [get_bd_addr_segs hls_rect_0/s_axi_AXILiteS/Reg]
assign_bd_address -offset 0x43C40000 -range 64K -target_address_space [get_bd_addr_spaces processing_system7_0/Data] [get_bd_addr_segs hls_preprocess_0/s_axi_AXILiteS/Reg]

validate_bd_design
save_bd_design
